# EAGLE design vga (EAGLE 5.12)

## Sheet 1 of 6
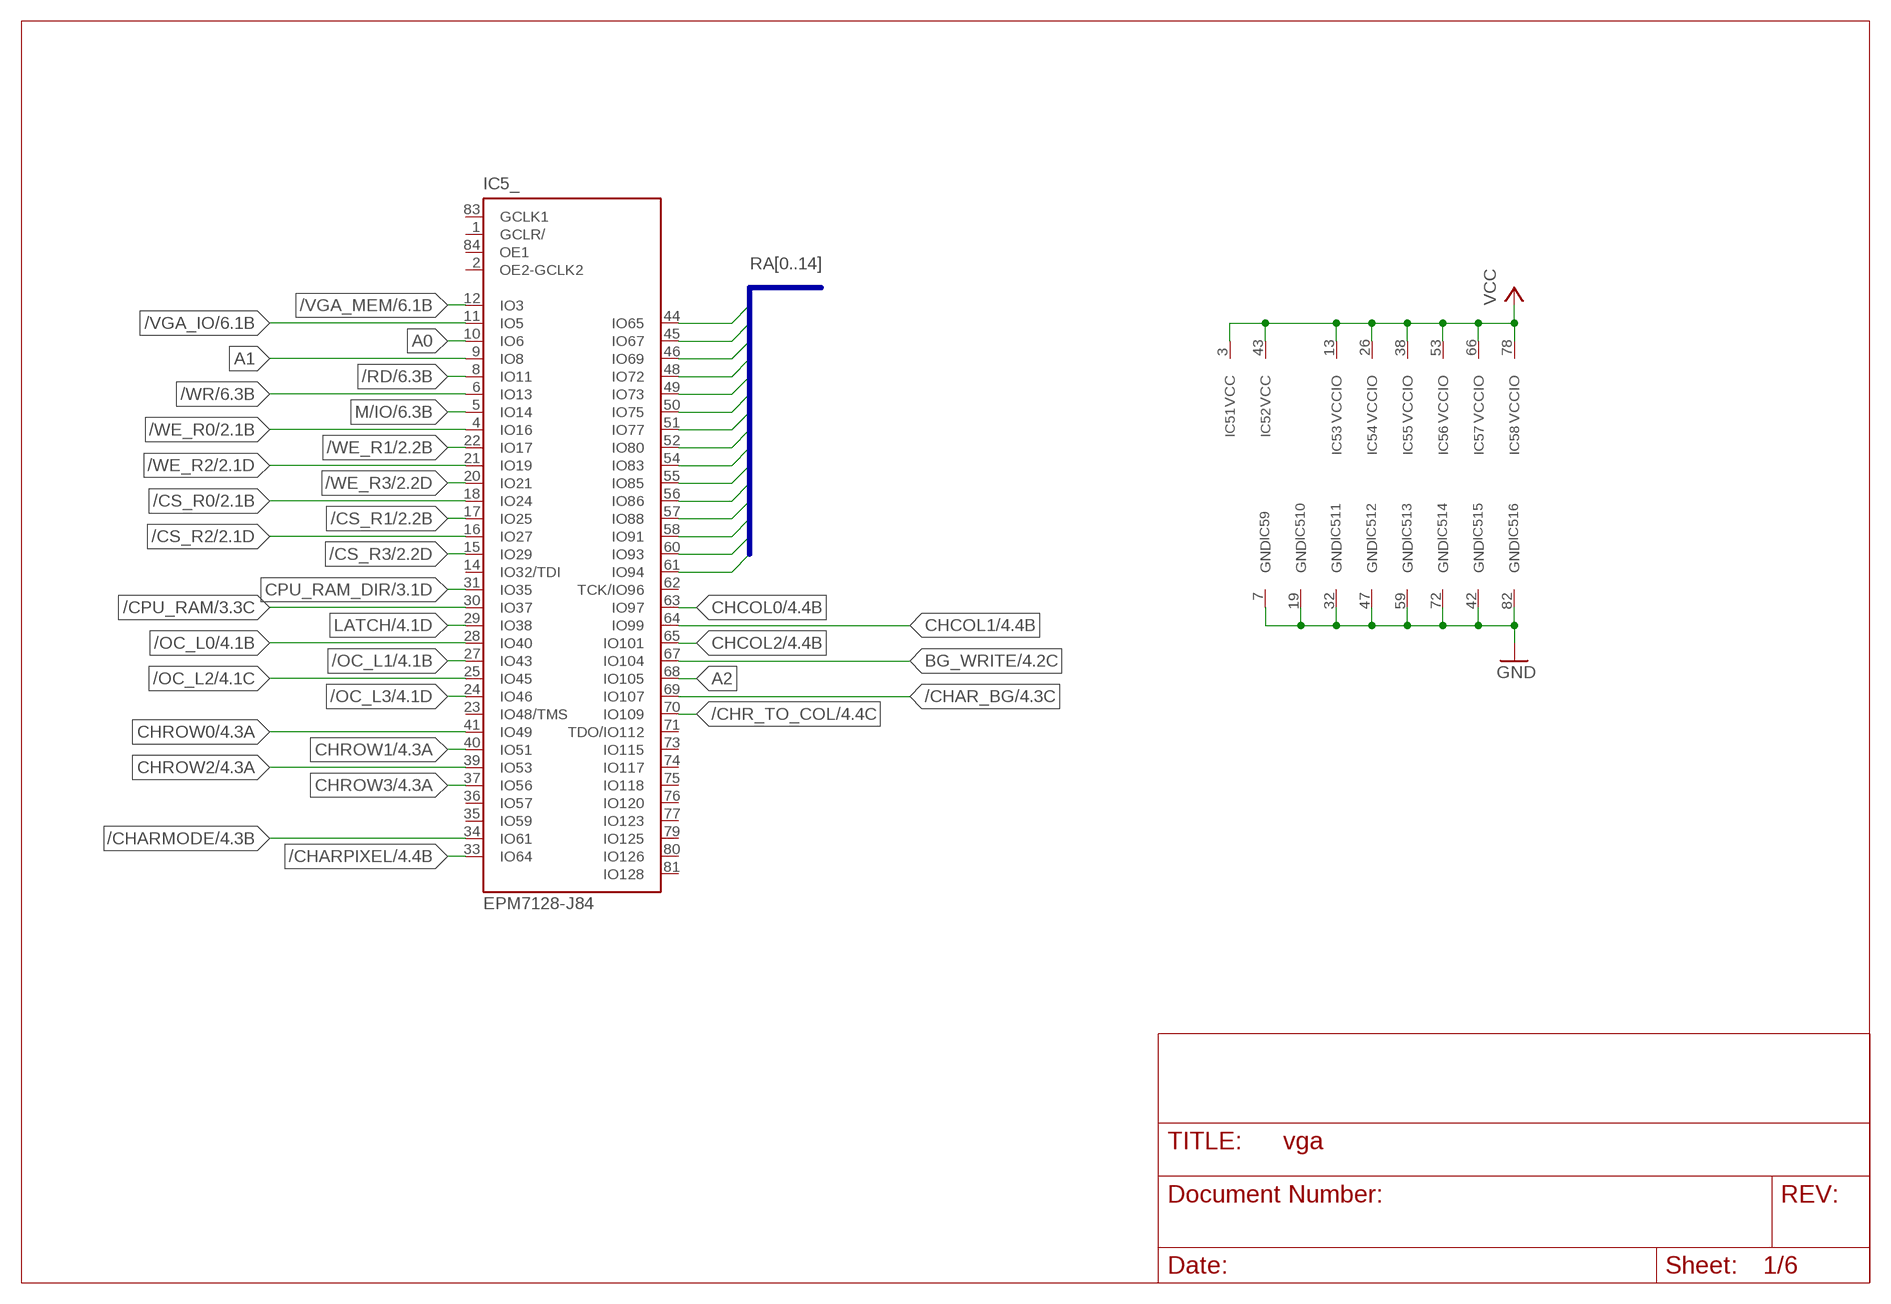
[diagram p0: schematic, sheet 1]

### Parts
IC5  EPM7128-J84  EPM7128-J84PLCC84-SOCKET  [S84]

### Nets
/CHARMODE: IC5.34(_:IO61) ; also sheet 4
/CHARPIXEL: IC5.33(_:IO64) ; also sheet 4
/CPU_RAM: IC5.30(_:IO37) ; also sheet 3
/CS_R0: IC5.18(_:IO24) ; also sheet 2
/CS_R1: IC5.17(_:IO25) ; also sheet 2
/CS_R2: IC5.16(_:IO27) ; also sheet 2
/CS_R3: IC5.15(_:IO29) ; also sheet 2
/OC_L0: IC5.28(_:IO40) ; also sheet 4
/OC_L1: IC5.27(_:IO43) ; also sheet 4
/OC_L2: IC5.25(_:IO45) ; also sheet 4
/OC_L3: IC5.24(_:IO46) ; also sheet 4
/RD: IC5.8(_:IO11) ; also sheet 6
/VGA_IO: IC5.11(_:IO5) ; also sheet 6
/VGA_MEM: IC5.12(_:IO3) ; also sheet 6
/WE_R0: IC5.4(_:IO16) ; also sheet 2
/WE_R1: IC5.22(_:IO17) ; also sheet 2
/WE_R2: IC5.21(_:IO19) ; also sheet 2
/WE_R3: IC5.20(_:IO21) ; also sheet 2
/WR: IC5.6(_:IO13) ; also sheet 6
A0: IC5.10(_:IO6) ; also sheet 6
A1: IC5.9(_:IO8) ; also sheet 6
CHROW0: IC5.41(_:IO49) ; also sheet 4
CHROW1: IC5.40(_:IO51) ; also sheet 4
CHROW2: IC5.39(_:IO53) ; also sheet 4
CHROW3: IC5.37(_:IO56) ; also sheet 4
CPU_RAM_DIR: IC5.31(_:IO35) ; also sheet 3
GND: IC5.7(9:GND) IC5.19(10:GND) IC5.32(11:GND) IC5.42(15:GND) IC5.47(12:GND) IC5.59(13:GND) IC5.72(14:GND) IC5.82(16:GND) ; also sheet 2,3,4,5,6
LATCH: IC5.29(_:IO38) ; also sheet 4
M/IO: IC5.5(_:IO14) ; also sheet 6
RA0: IC5.44(_:IO65) ; also sheet 2,3
RA1: IC5.45(_:IO67) ; also sheet 2,3
RA2: IC5.46(_:IO69) ; also sheet 2,3
RA3: IC5.48(_:IO72) ; also sheet 2,3
RA4: IC5.49(_:IO73) ; also sheet 2,3
RA5: IC5.50(_:IO75) ; also sheet 2,3
RA6: IC5.51(_:IO77) ; also sheet 2,3
RA7: IC5.52(_:IO80) ; also sheet 2,3
RA8: IC5.54(_:IO83) ; also sheet 2,3
RA9: IC5.55(_:IO85) ; also sheet 2,3
RA10: IC5.56(_:IO86) ; also sheet 2,3
RA11: IC5.57(_:IO88) ; also sheet 2,3
RA12: IC5.58(_:IO91) ; also sheet 2,3
RA13: IC5.60(_:IO93) ; also sheet 2,3
RA14: IC5.61(_:IO94) ; also sheet 2,3
VCC: IC5.3(1:VCC) IC5.13(3:VCCIO) IC5.26(4:VCCIO) IC5.38(5:VCCIO) IC5.43(2:VCC) IC5.53(6:VCCIO) IC5.66(7:VCCIO) IC5.78(8:VCCIO) ; also sheet 2,3,4,6
Unconnected: IC5.1(_:GCLR/) IC5.2(_:OE2-GCLK2) IC5.14(_:IO32/TDI) IC5.23(_:IO48/TMS) IC5.35(_:IO59) IC5.36(_:IO57) IC5.62(_:TCK/IO96) IC5.63(_:IO97) IC5.64(_:IO99) IC5.65(_:IO101) IC5.67(_:IO104) IC5.68(_:IO105) IC5.69(_:IO107) IC5.70(_:IO109) IC5.71(_:TDO/IO112) IC5.73(_:IO115) IC5.74(_:IO117) IC5.75(_:IO118) IC5.76(_:IO120) IC5.77(_:IO123) IC5.79(_:IO125) IC5.80(_:IO126) IC5.81(_:IO128) IC5.83(_:GCLK1) IC5.84(_:OE1)

### Buses
RA[0..14]

## Sheet 2 of 6
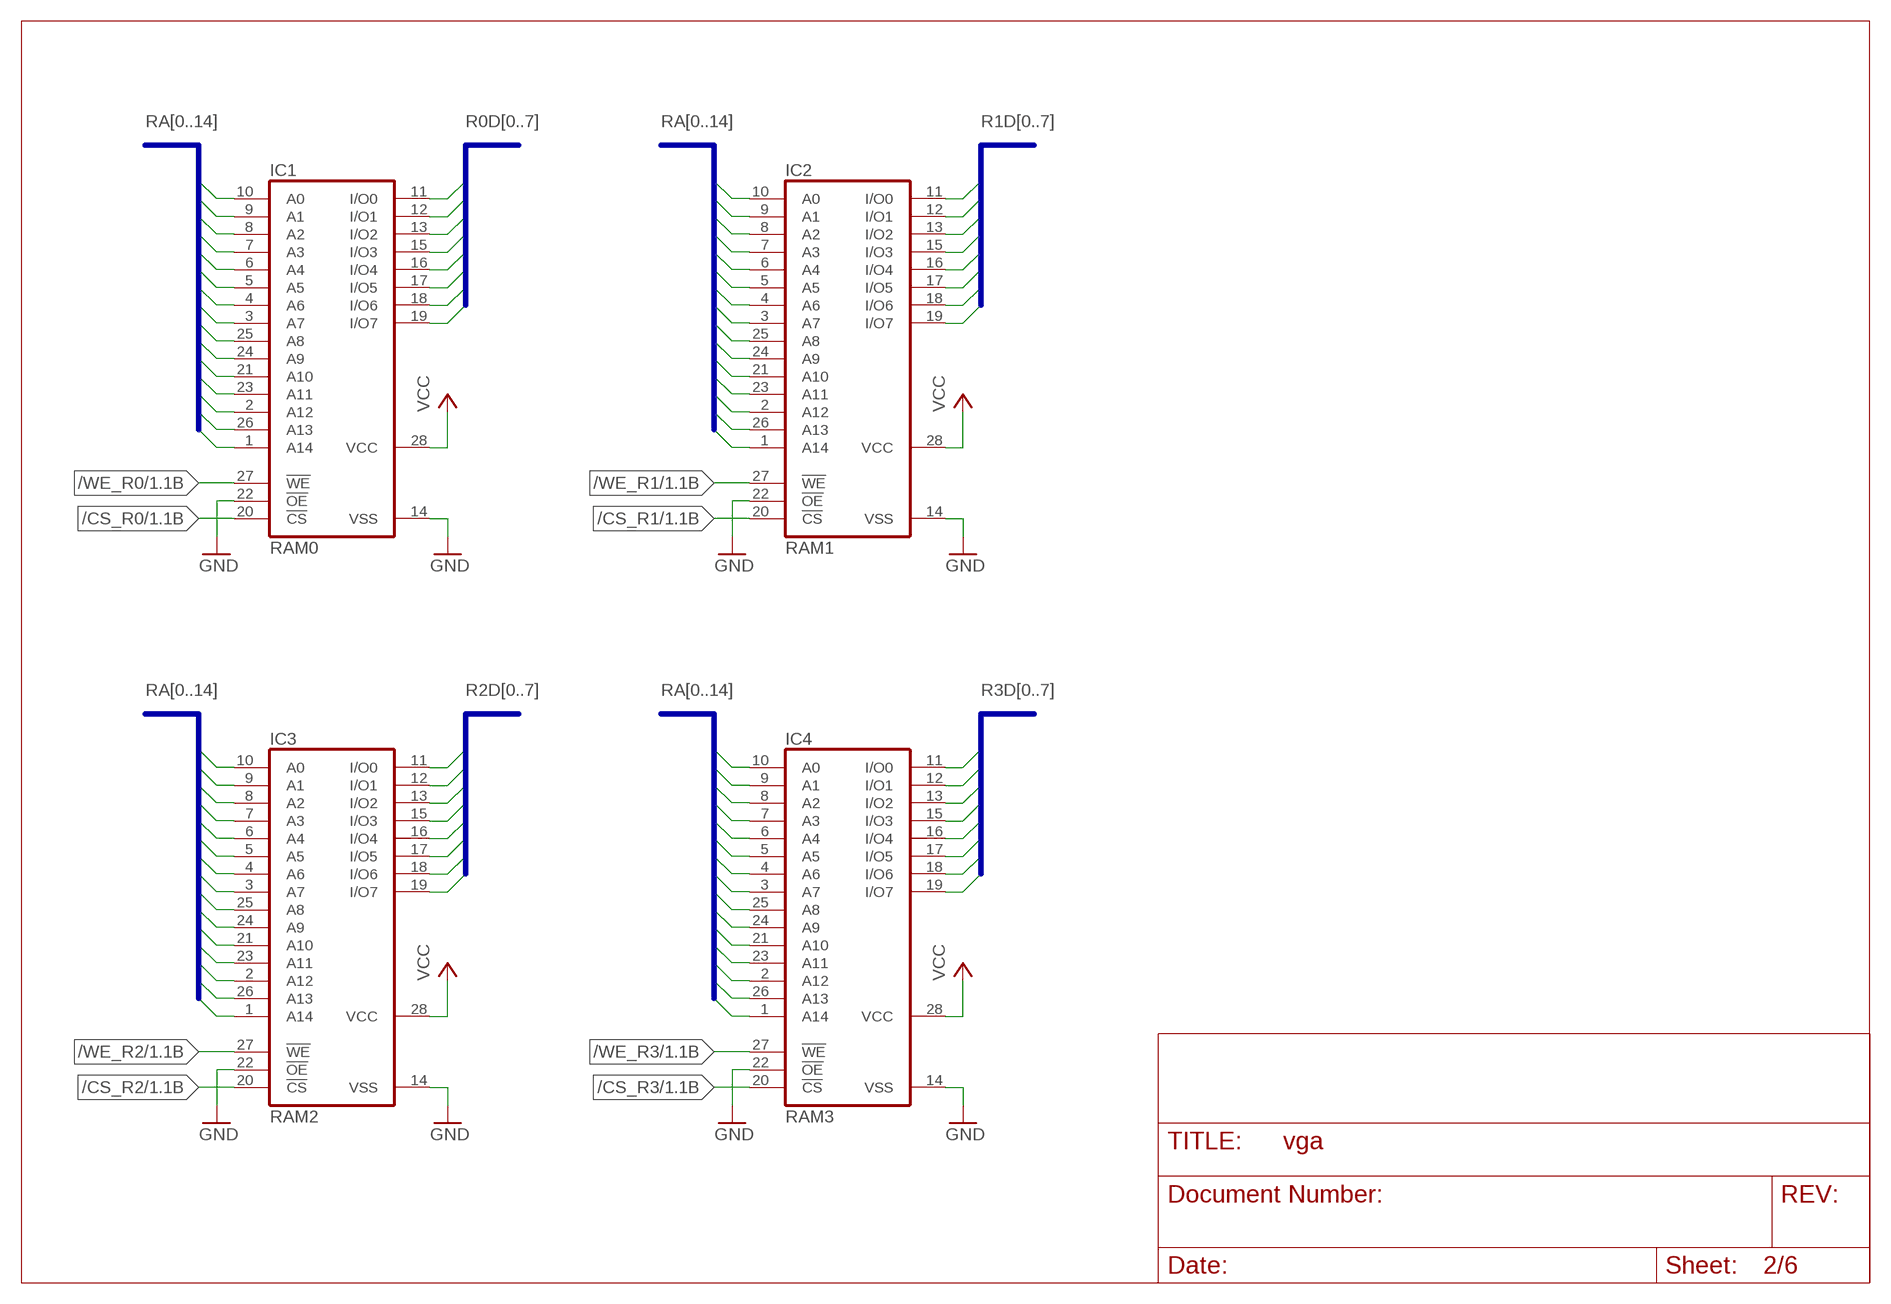
[diagram p1: schematic, sheet 2]

### Parts
IC1  RAM0  62832P  [DIL28-3]
IC2  RAM1  62832P  [DIL28-3]
IC3  RAM2  62832P  [DIL28-3]
IC4  RAM3  62832P  [DIL28-3]

### Nets
/CS_R0: IC1.20(!CS) ; also sheet 1
/CS_R1: IC2.20(!CS) ; also sheet 1
/CS_R2: IC3.20(!CS) ; also sheet 1
/CS_R3: IC4.20(!CS) ; also sheet 1
/WE_R0: IC1.27(!WE) ; also sheet 1
/WE_R1: IC2.27(!WE) ; also sheet 1
/WE_R2: IC3.27(!WE) ; also sheet 1
/WE_R3: IC4.27(!WE) ; also sheet 1
GND: IC1.14(VSS) IC1.22(!OE) IC2.14(VSS) IC2.22(!OE) IC3.14(VSS) IC3.22(!OE) IC4.14(VSS) IC4.22(!OE) ; also sheet 1,3,4,5,6
R0D0: IC1.11(I/O0) ; also sheet 3,4
R0D1: IC1.12(I/O1) ; also sheet 3,4
R0D2: IC1.13(I/O2) ; also sheet 3,4
R0D3: IC1.15(I/O3) ; also sheet 3,4
R0D4: IC1.16(I/O4) ; also sheet 3,4
R0D5: IC1.17(I/O5) ; also sheet 3,4
R0D6: IC1.18(I/O6) ; also sheet 3,4
R0D7: IC1.19(I/O7) ; also sheet 3,4
R1D0: IC2.11(I/O0) ; also sheet 3,4
R1D1: IC2.12(I/O1) ; also sheet 3,4
R1D2: IC2.13(I/O2) ; also sheet 3,4
R1D3: IC2.15(I/O3) ; also sheet 3,4
R1D4: IC2.16(I/O4) ; also sheet 3,4
R1D5: IC2.17(I/O5) ; also sheet 3,4
R1D6: IC2.18(I/O6) ; also sheet 3,4
R1D7: IC2.19(I/O7) ; also sheet 3,4
R2D0: IC3.11(I/O0) ; also sheet 3,4
R2D1: IC3.12(I/O1) ; also sheet 3,4
R2D2: IC3.13(I/O2) ; also sheet 3,4
R2D3: IC3.15(I/O3) ; also sheet 3,4
R2D4: IC3.16(I/O4) ; also sheet 3,4
R2D5: IC3.17(I/O5) ; also sheet 3,4
R2D6: IC3.18(I/O6) ; also sheet 3,4
R2D7: IC3.19(I/O7) ; also sheet 3,4
R3D0: IC4.11(I/O0) ; also sheet 3,4
R3D1: IC4.12(I/O1) ; also sheet 3,4
R3D2: IC4.13(I/O2) ; also sheet 3,4
R3D3: IC4.15(I/O3) ; also sheet 3,4
R3D4: IC4.16(I/O4) ; also sheet 3,4
R3D5: IC4.17(I/O5) ; also sheet 3,4
R3D6: IC4.18(I/O6) ; also sheet 3,4
R3D7: IC4.19(I/O7) ; also sheet 3,4
RA0: IC1.10(A0) IC2.10(A0) IC3.10(A0) IC4.10(A0) ; also sheet 1,3
RA1: IC1.9(A1) IC2.9(A1) IC3.9(A1) IC4.9(A1) ; also sheet 1,3
RA2: IC1.8(A2) IC2.8(A2) IC3.8(A2) IC4.8(A2) ; also sheet 1,3
RA3: IC1.7(A3) IC2.7(A3) IC3.7(A3) IC4.7(A3) ; also sheet 1,3
RA4: IC1.6(A4) IC2.6(A4) IC3.6(A4) IC4.6(A4) ; also sheet 1,3
RA5: IC1.5(A5) IC2.5(A5) IC3.5(A5) IC4.5(A5) ; also sheet 1,3
RA6: IC1.4(A6) IC2.4(A6) IC3.4(A6) IC4.4(A6) ; also sheet 1,3
RA7: IC1.3(A7) IC2.3(A7) IC3.3(A7) IC4.3(A7) ; also sheet 1,3
RA8: IC1.25(A8) IC2.25(A8) IC3.25(A8) IC4.25(A8) ; also sheet 1,3
RA9: IC1.24(A9) IC2.24(A9) IC3.24(A9) IC4.24(A9) ; also sheet 1,3
RA10: IC1.21(A10) IC2.21(A10) IC3.21(A10) IC4.21(A10) ; also sheet 1,3
RA11: IC1.23(A11) IC2.23(A11) IC3.23(A11) IC4.23(A11) ; also sheet 1,3
RA12: IC1.2(A12) IC2.2(A12) IC3.2(A12) IC4.2(A12) ; also sheet 1,3
RA13: IC1.26(A13) IC2.26(A13) IC3.26(A13) IC4.26(A13) ; also sheet 1,3
RA14: IC1.1(A14) IC2.1(A14) IC3.1(A14) IC4.1(A14) ; also sheet 1,3
VCC: IC1.28(VCC) IC2.28(VCC) IC3.28(VCC) IC4.28(VCC) ; also sheet 1,3,4,6

### Buses
RA[0..14]
R0D[0..7]
R1D[0..7]
R2D[0..7]
R3D[0..7]

## Sheet 3 of 6
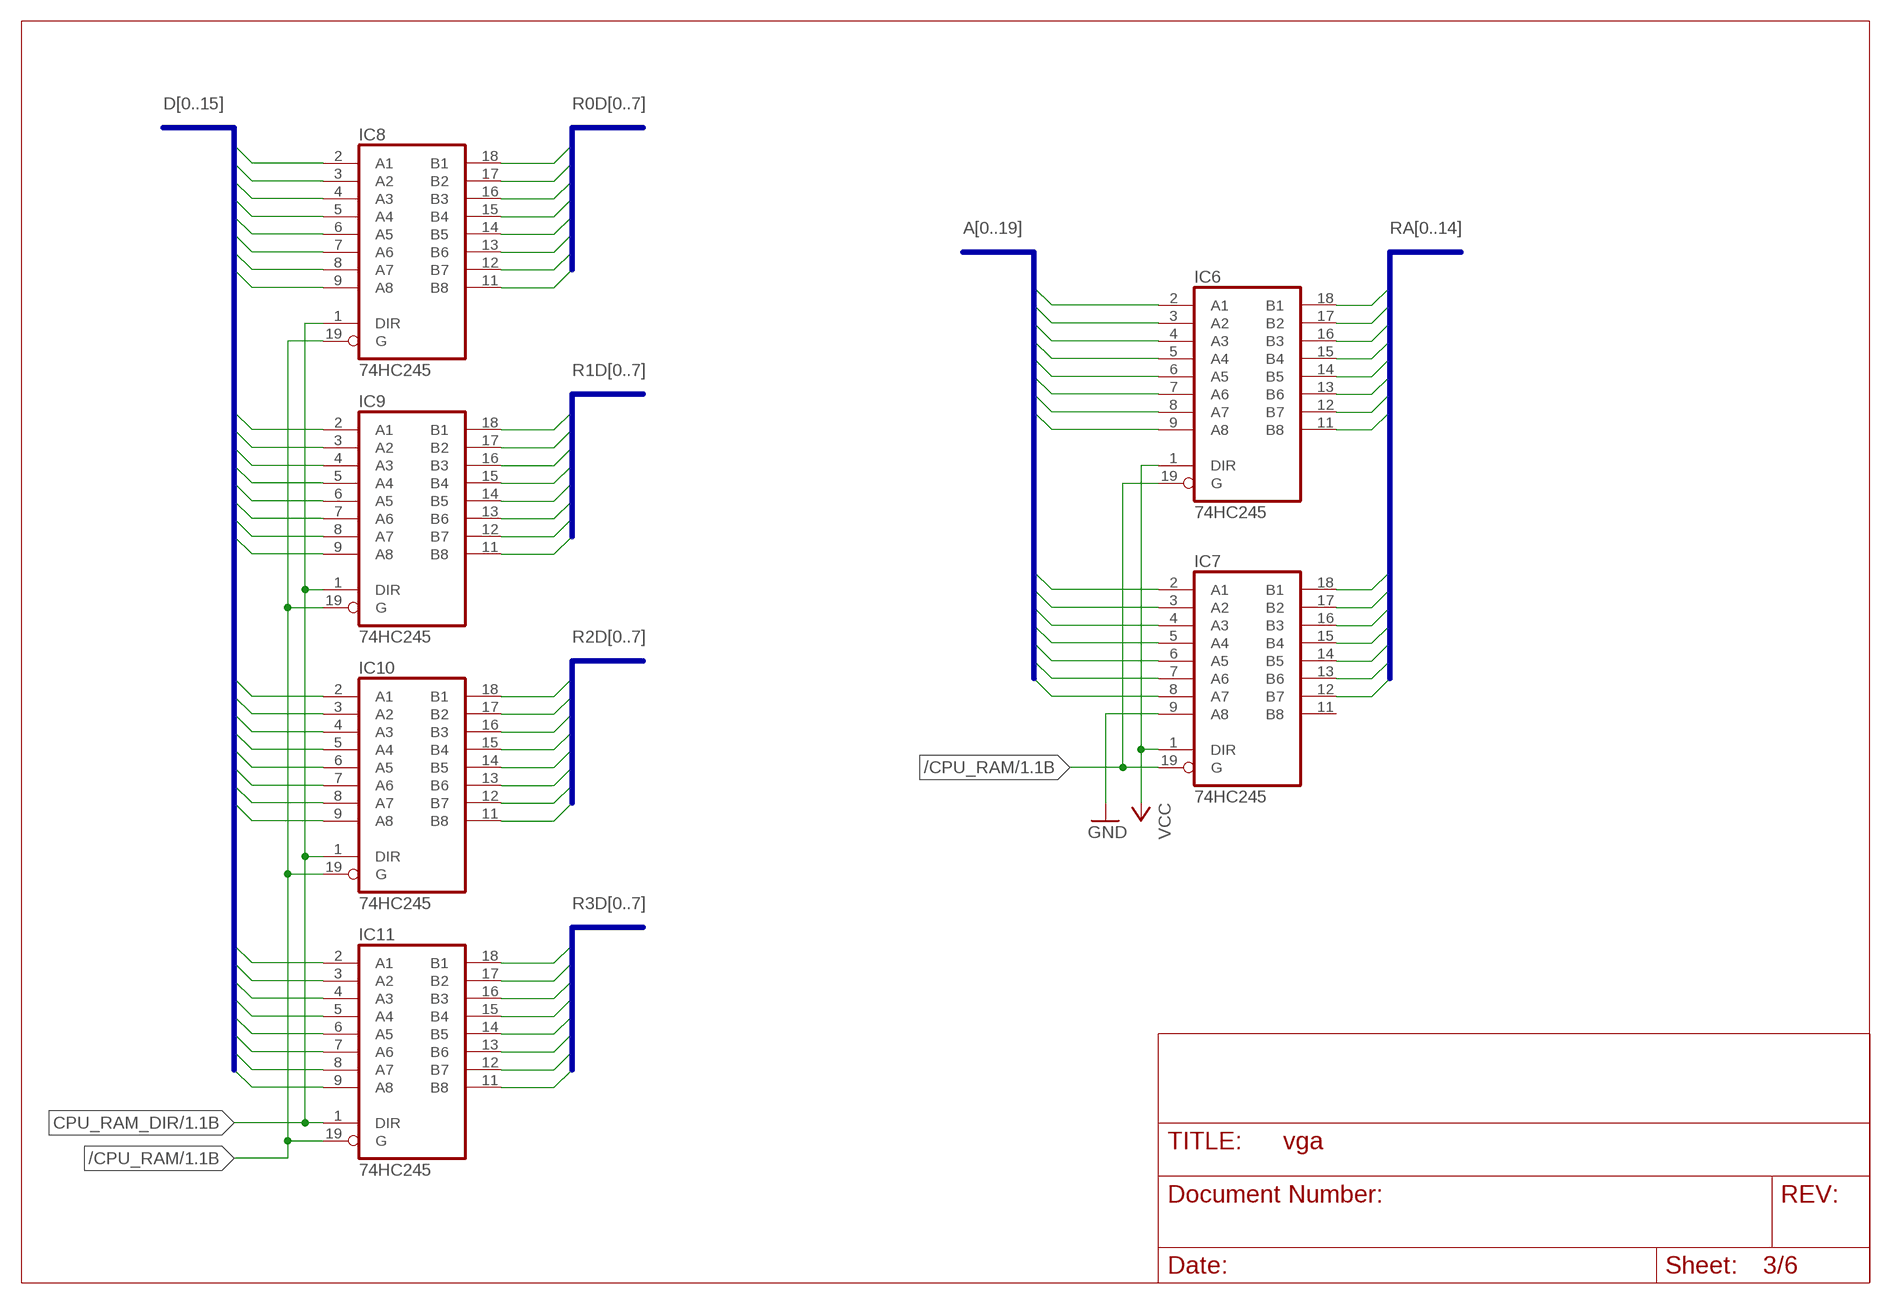
[diagram p2: schematic, sheet 3]

### Parts
IC6  74HC245  74LS245DW  [SO20W]
IC7  74HC245  74LS245DW  [SO20W]
IC8  74HC245  74LS245DW  [SO20W]
IC9  74HC245  74LS245DW  [SO20W]
IC10  74HC245  74LS245DW  [SO20W]
IC11  74HC245  74LS245DW  [SO20W]

### Nets
/CPU_RAM: IC6.19(G) IC7.19(G) IC8.19(G) IC9.19(G) IC10.19(G) IC11.19(G) ; also sheet 1
A2: IC6.2(A1) ; also sheet 1,6
A3: IC6.3(A2) ; also sheet 6
A4: IC6.4(A3) ; also sheet 6
A5: IC6.5(A4) ; also sheet 6
A6: IC6.6(A5) ; also sheet 6
A7: IC6.7(A6) ; also sheet 6
A8: IC6.8(A7) ; also sheet 6
A9: IC6.9(A8) ; also sheet 6
A10: IC7.2(A1) ; also sheet 6
A11: IC7.3(A2) ; also sheet 6
A12: IC7.4(A3) ; also sheet 6
A13: IC7.5(A4) ; also sheet 6
A14: IC7.6(A5) ; also sheet 6
A15: IC7.7(A6) ; also sheet 6
A16: IC7.8(A7) ; also sheet 6
CPU_RAM_DIR: IC8.1(DIR) IC9.1(DIR) IC10.1(DIR) IC11.1(DIR) ; also sheet 1
D0: IC8.2(A1) IC10.2(A1) ; also sheet 4,6
D1: IC8.3(A2) IC10.3(A2) ; also sheet 4,6
D2: IC8.4(A3) IC10.4(A3) ; also sheet 4,6
D3: IC8.5(A4) IC10.5(A4) ; also sheet 4,6
D4: IC8.6(A5) IC10.6(A5) ; also sheet 4,6
D5: IC8.7(A6) IC10.7(A6) ; also sheet 4,6
D6: IC8.8(A7) IC10.8(A7) ; also sheet 4,6
D7: IC8.9(A8) IC10.9(A8) ; also sheet 4,6
D8: IC9.2(A1) IC11.2(A1) ; also sheet 6
D9: IC9.3(A2) IC11.3(A2) ; also sheet 6
D10: IC9.4(A3) IC11.4(A3) ; also sheet 6
D11: IC9.5(A4) IC11.5(A4) ; also sheet 6
D12: IC9.6(A5) IC11.6(A5) ; also sheet 6
D13: IC9.7(A6) IC11.7(A6) ; also sheet 6
D14: IC9.8(A7) IC11.8(A7) ; also sheet 6
D15: IC9.9(A8) IC11.9(A8) ; also sheet 6
GND: IC7.9(A8) ; also sheet 1,2,4,5,6
R0D0: IC8.18(B1) ; also sheet 2,4
R0D1: IC8.17(B2) ; also sheet 2,4
R0D2: IC8.16(B3) ; also sheet 2,4
R0D3: IC8.15(B4) ; also sheet 2,4
R0D4: IC8.14(B5) ; also sheet 2,4
R0D5: IC8.13(B6) ; also sheet 2,4
R0D6: IC8.12(B7) ; also sheet 2,4
R0D7: IC8.11(B8) ; also sheet 2,4
R1D0: IC9.18(B1) ; also sheet 2,4
R1D1: IC9.17(B2) ; also sheet 2,4
R1D2: IC9.16(B3) ; also sheet 2,4
R1D3: IC9.15(B4) ; also sheet 2,4
R1D4: IC9.14(B5) ; also sheet 2,4
R1D5: IC9.13(B6) ; also sheet 2,4
R1D6: IC9.12(B7) ; also sheet 2,4
R1D7: IC9.11(B8) ; also sheet 2,4
R2D0: IC10.18(B1) ; also sheet 2,4
R2D1: IC10.17(B2) ; also sheet 2,4
R2D2: IC10.16(B3) ; also sheet 2,4
R2D3: IC10.15(B4) ; also sheet 2,4
R2D4: IC10.14(B5) ; also sheet 2,4
R2D5: IC10.13(B6) ; also sheet 2,4
R2D6: IC10.12(B7) ; also sheet 2,4
R2D7: IC10.11(B8) ; also sheet 2,4
R3D0: IC11.18(B1) ; also sheet 2,4
R3D1: IC11.17(B2) ; also sheet 2,4
R3D2: IC11.16(B3) ; also sheet 2,4
R3D3: IC11.15(B4) ; also sheet 2,4
R3D4: IC11.14(B5) ; also sheet 2,4
R3D5: IC11.13(B6) ; also sheet 2,4
R3D6: IC11.12(B7) ; also sheet 2,4
R3D7: IC11.11(B8) ; also sheet 2,4
RA0: IC6.18(B1) ; also sheet 1,2
RA1: IC6.17(B2) ; also sheet 1,2
RA2: IC6.16(B3) ; also sheet 1,2
RA3: IC6.15(B4) ; also sheet 1,2
RA4: IC6.14(B5) ; also sheet 1,2
RA5: IC6.13(B6) ; also sheet 1,2
RA6: IC6.12(B7) ; also sheet 1,2
RA7: IC6.11(B8) ; also sheet 1,2
RA8: IC7.18(B1) ; also sheet 1,2
RA9: IC7.17(B2) ; also sheet 1,2
RA10: IC7.16(B3) ; also sheet 1,2
RA11: IC7.15(B4) ; also sheet 1,2
RA12: IC7.14(B5) ; also sheet 1,2
RA13: IC7.13(B6) ; also sheet 1,2
RA14: IC7.12(B7) ; also sheet 1,2
VCC: IC6.1(DIR) IC7.1(DIR) ; also sheet 1,2,4,6
Unconnected: IC7.11(B8)

### Buses
D[0..15]
R3D[0..7]
R0D[0..7]
R1D[0..7]
R2D[0..7]
RA[0..14]
A[0..19]

## Sheet 4 of 6
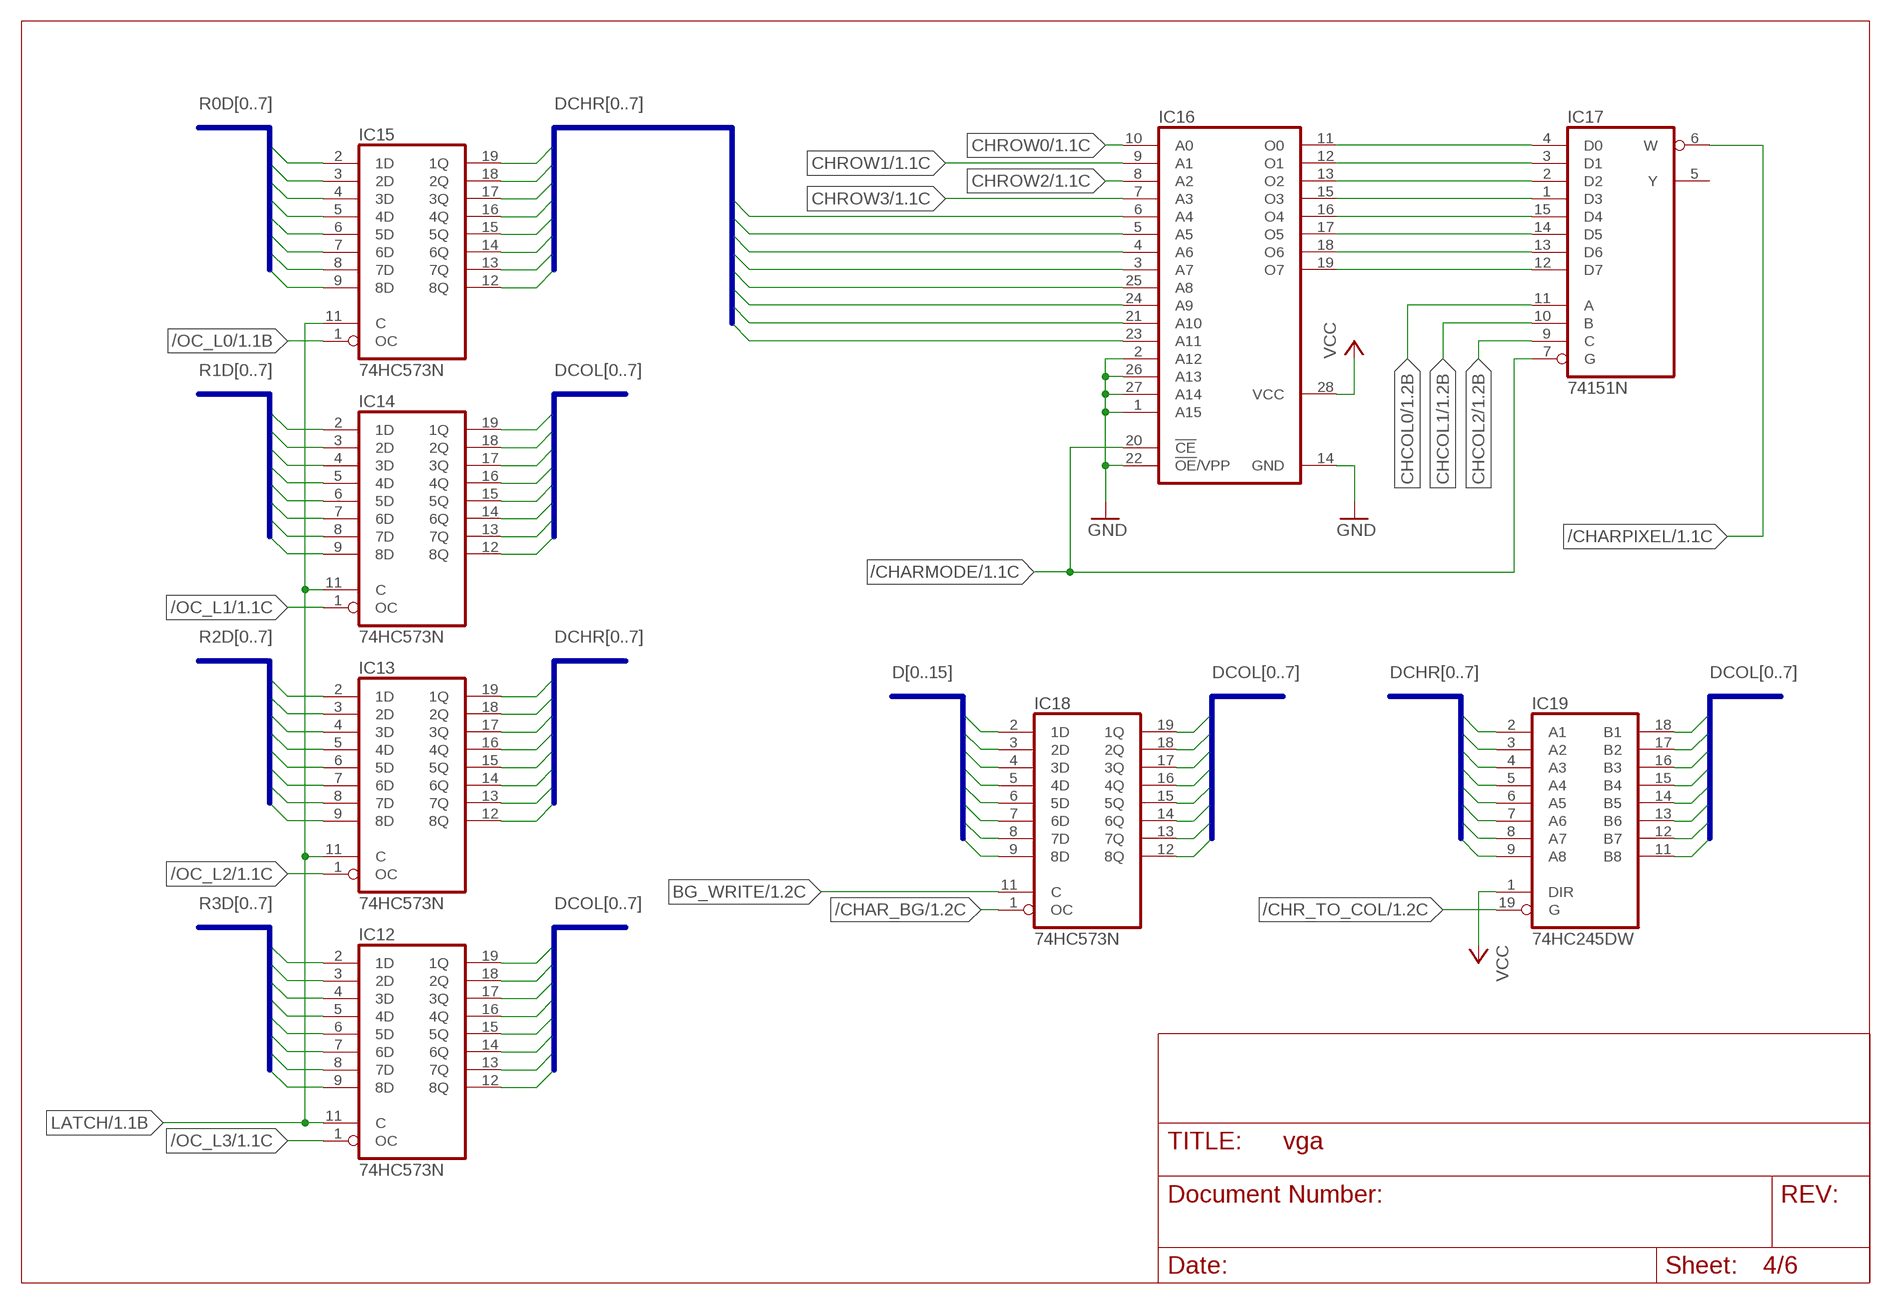
[diagram p3: schematic, sheet 4]

### Parts
IC12  74HC573N  [DIL20]
IC13  74HC573N  [DIL20]
IC14  74HC573N  [DIL20]
IC15  74HC573N  [DIL20]
IC16  27C512D  [DIL28-6]
IC17  74151N  [DIL16]
IC18  74HC573N  [DIL20]
IC19  74HC245DW  [SO20W]

### Nets
/CHAR_BG: IC18.1(OC) ; also sheet 1
/CHARMODE: IC16.20(!CE) IC17.7(G) ; also sheet 1
/CHARPIXEL: IC17.6(W) ; also sheet 1
/CHR_TO_COL: IC19.19(G) ; also sheet 1
/OC_L0: IC15.1(OC) ; also sheet 1
/OC_L1: IC14.1(OC) ; also sheet 1
/OC_L2: IC13.1(OC) ; also sheet 1
/OC_L3: IC12.1(OC) ; also sheet 1
BG_WRITE: IC18.11(C) ; also sheet 1
CHCOL0: IC17.11(A) ; also sheet 1
CHCOL1: IC17.10(B) ; also sheet 1
CHCOL2: IC17.9(C) ; also sheet 1
CHROW0: IC16.10(A0) ; also sheet 1
CHROW1: IC16.9(A1) ; also sheet 1
CHROW2: IC16.8(A2) ; also sheet 1
CHROW3: IC16.7(A3) ; also sheet 1
D0: IC18.2(1D) ; also sheet 3,6
D1: IC18.3(2D) ; also sheet 3,6
D2: IC18.4(3D) ; also sheet 3,6
D3: IC18.5(4D) ; also sheet 3,6
D4: IC18.6(5D) ; also sheet 3,6
D5: IC18.7(6D) ; also sheet 3,6
D6: IC18.8(7D) ; also sheet 3,6
D7: IC18.9(8D) ; also sheet 3,6
DCHR0: IC13.19(1Q) IC15.19(1Q) IC16.6(A4) IC19.2(A1)
DCHR1: IC13.18(2Q) IC15.18(2Q) IC16.5(A5) IC19.3(A2)
DCHR2: IC13.17(3Q) IC15.17(3Q) IC16.4(A6) IC19.4(A3)
DCHR3: IC13.16(4Q) IC15.16(4Q) IC16.3(A7) IC19.5(A4)
DCHR4: IC13.15(5Q) IC15.15(5Q) IC16.25(A8) IC19.6(A5)
DCHR5: IC13.14(6Q) IC15.14(6Q) IC16.24(A9) IC19.7(A6)
DCHR6: IC13.13(7Q) IC15.13(7Q) IC16.21(A10) IC19.8(A7)
DCHR7: IC13.12(8Q) IC15.12(8Q) IC16.23(A11) IC19.9(A8)
DCOL0: IC12.19(1Q) IC14.19(1Q) IC18.19(1Q) IC19.18(B1) ; also sheet 5
DCOL1: IC12.18(2Q) IC14.18(2Q) IC18.18(2Q) IC19.17(B2) ; also sheet 5
DCOL2: IC12.17(3Q) IC14.17(3Q) IC18.17(3Q) IC19.16(B3) ; also sheet 5
DCOL3: IC12.16(4Q) IC14.16(4Q) IC18.16(4Q) IC19.15(B4) ; also sheet 5
DCOL4: IC12.15(5Q) IC14.15(5Q) IC18.15(5Q) IC19.14(B5) ; also sheet 5
DCOL5: IC12.14(6Q) IC14.14(6Q) IC18.14(6Q) IC19.13(B6) ; also sheet 5
DCOL6: IC12.13(7Q) IC14.13(7Q) IC18.13(7Q) IC19.12(B7) ; also sheet 5
DCOL7: IC12.12(8Q) IC14.12(8Q) IC18.12(8Q) IC19.11(B8) ; also sheet 5
GND: IC16.1(A15) IC16.2(A12) IC16.14(GND) IC16.22(!OE!/VPP) IC16.26(A13) IC16.27(A14) ; also sheet 1,2,3,5,6
LATCH: IC12.11(C) IC13.11(C) IC14.11(C) IC15.11(C) ; also sheet 1
N$3: IC16.15(O3) IC17.1(D3)
N$4: IC16.13(O2) IC17.2(D2)
N$5: IC16.12(O1) IC17.3(D1)
N$6: IC16.11(O0) IC17.4(D0)
N$7: IC16.19(O7) IC17.12(D7)
N$8: IC16.18(O6) IC17.13(D6)
N$9: IC16.17(O5) IC17.14(D5)
N$10: IC16.16(O4) IC17.15(D4)
R0D0: IC15.2(1D) ; also sheet 2,3
R0D1: IC15.3(2D) ; also sheet 2,3
R0D2: IC15.4(3D) ; also sheet 2,3
R0D3: IC15.5(4D) ; also sheet 2,3
R0D4: IC15.6(5D) ; also sheet 2,3
R0D5: IC15.7(6D) ; also sheet 2,3
R0D6: IC15.8(7D) ; also sheet 2,3
R0D7: IC15.9(8D) ; also sheet 2,3
R1D0: IC14.2(1D) ; also sheet 2,3
R1D1: IC14.3(2D) ; also sheet 2,3
R1D2: IC14.4(3D) ; also sheet 2,3
R1D3: IC14.5(4D) ; also sheet 2,3
R1D4: IC14.6(5D) ; also sheet 2,3
R1D5: IC14.7(6D) ; also sheet 2,3
R1D6: IC14.8(7D) ; also sheet 2,3
R1D7: IC14.9(8D) ; also sheet 2,3
R2D0: IC13.2(1D) ; also sheet 2,3
R2D1: IC13.3(2D) ; also sheet 2,3
R2D2: IC13.4(3D) ; also sheet 2,3
R2D3: IC13.5(4D) ; also sheet 2,3
R2D4: IC13.6(5D) ; also sheet 2,3
R2D5: IC13.7(6D) ; also sheet 2,3
R2D6: IC13.8(7D) ; also sheet 2,3
R2D7: IC13.9(8D) ; also sheet 2,3
R3D0: IC12.2(1D) ; also sheet 2,3
R3D1: IC12.3(2D) ; also sheet 2,3
R3D2: IC12.4(3D) ; also sheet 2,3
R3D3: IC12.5(4D) ; also sheet 2,3
R3D4: IC12.6(5D) ; also sheet 2,3
R3D5: IC12.7(6D) ; also sheet 2,3
R3D6: IC12.8(7D) ; also sheet 2,3
R3D7: IC12.9(8D) ; also sheet 2,3
VCC: IC16.28(VCC) IC19.1(DIR) ; also sheet 1,2,3,6
Unconnected: IC17.5(Y)

### Buses
R3D[0..7]
R0D[0..7]
R1D[0..7]
R2D[0..7]
DCOL[0..7]
DCHR[0..7]
D[0..15]

## Sheet 5 of 6
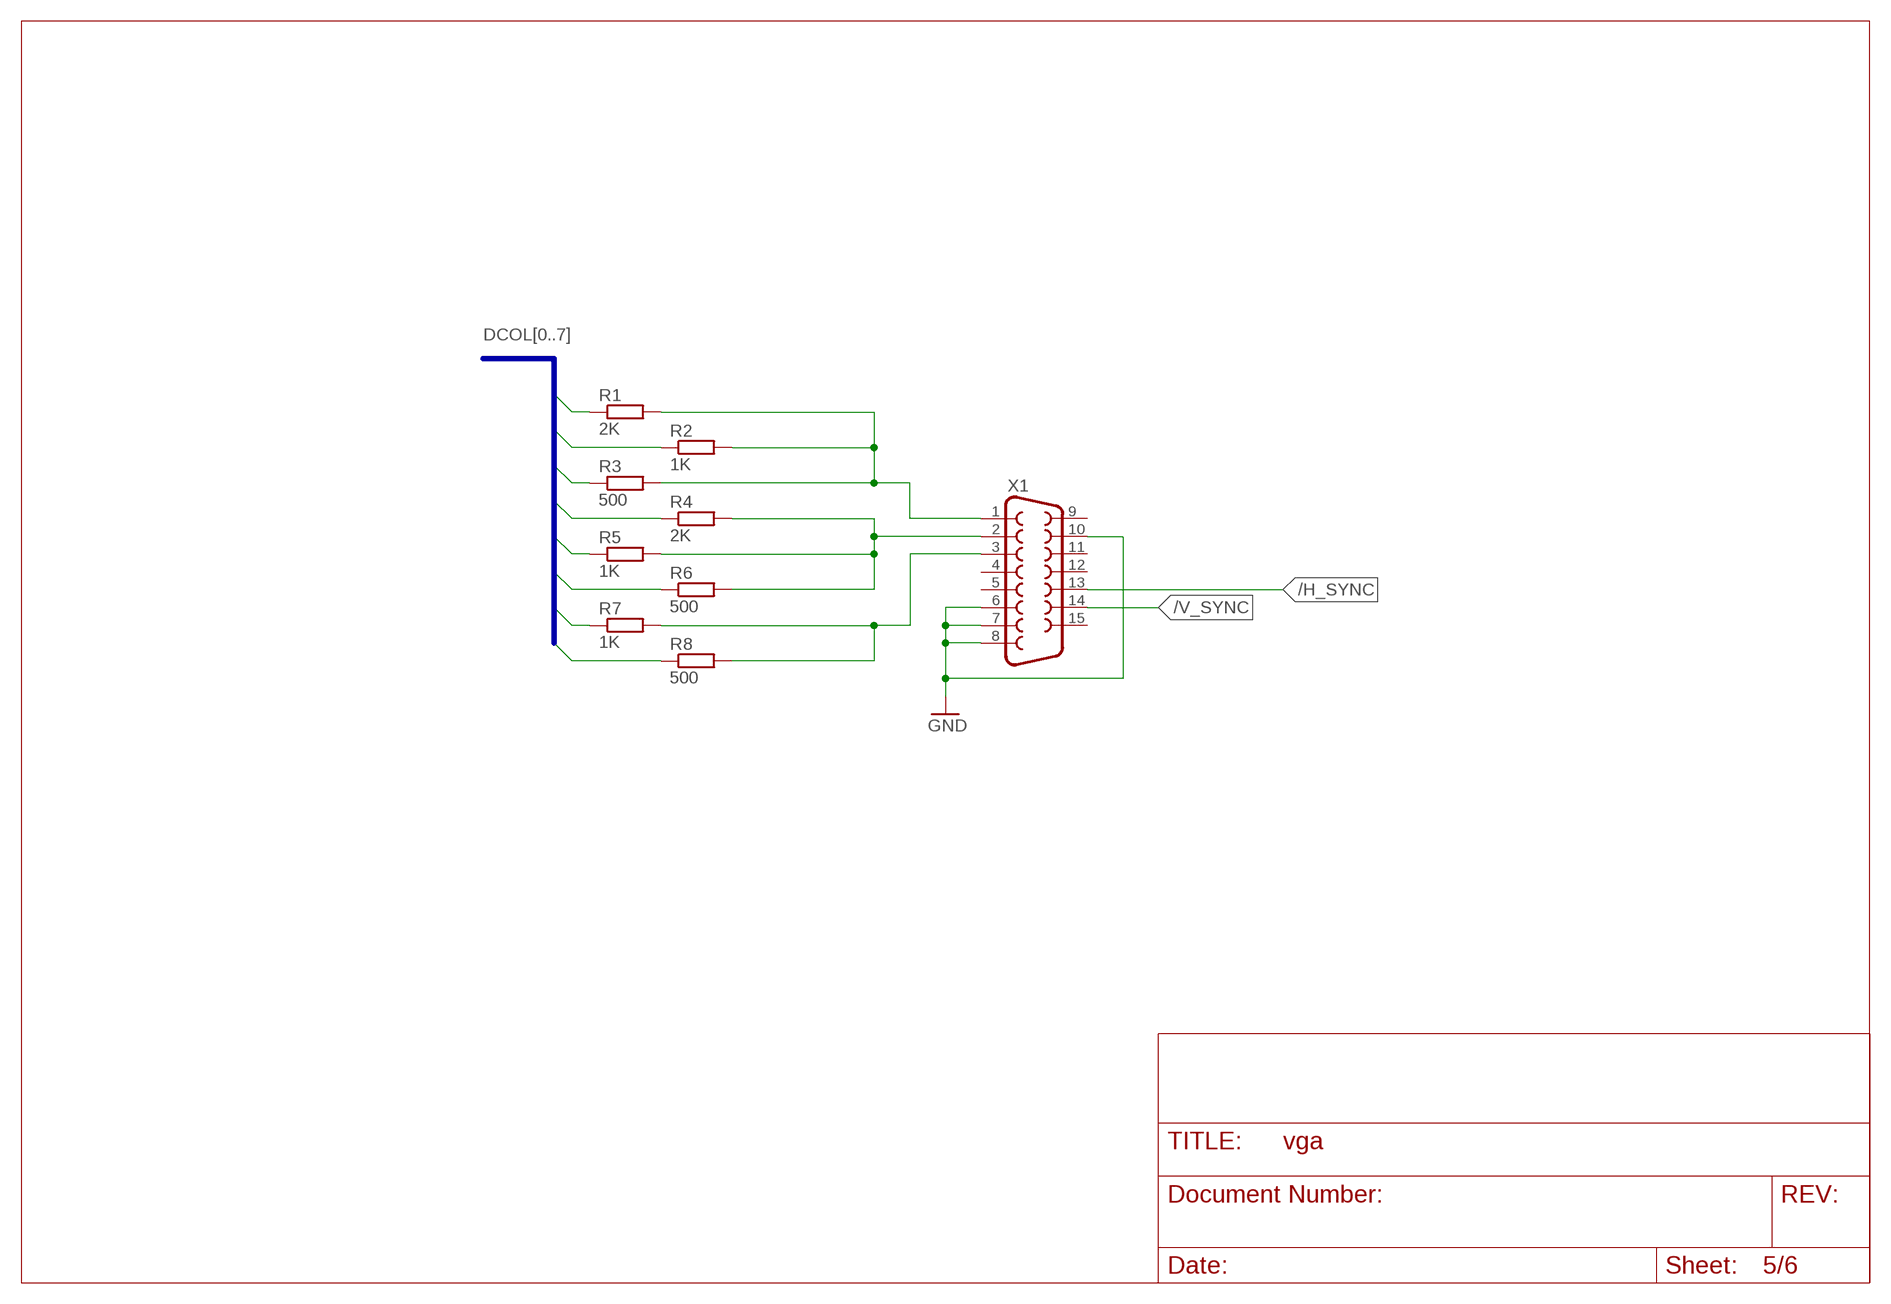
[diagram p4: schematic, sheet 5]

### Parts
R1  2K  R-EU_0207/2V  [0207/2V]
R2  1K  R-EU_0207/2V  [0207/2V]
R3  500  R-EU_0207/2V  [0207/2V]
R4  2K  R-EU_0207/2V  [0207/2V]
R5  1K  R-EU_0207/2V  [0207/2V]
R6  500  R-EU_0207/2V  [0207/2V]
R7  1K  R-EU_0207/2V  [0207/2V]
R8  500  R-EU_0207/2V  [0207/2V]
X1  F15HDH  [HDF15H]

### Nets
/H_SYNC: X1.13
/V_SYNC: X1.14
DCOL0: R1.1 ; also sheet 4
DCOL1: R2.1 ; also sheet 4
DCOL2: R3.1 ; also sheet 4
DCOL3: R4.1 ; also sheet 4
DCOL4: R5.1 ; also sheet 4
DCOL5: R6.1 ; also sheet 4
DCOL6: R7.1 ; also sheet 4
DCOL7: R8.1 ; also sheet 4
GND: X1.6 X1.7 X1.8 X1.10 ; also sheet 1,2,3,4,6
RGB_B: R7.2 R8.2 X1.3
RGB_G: R4.2 R5.2 R6.2 X1.2
RGB_R: R1.2 R2.2 R3.2 X1.1
Unconnected: X1.4 X1.5 X1.9 X1.11 X1.12 X1.15

### Buses
DCOL[0..7]

## Sheet 6 of 6
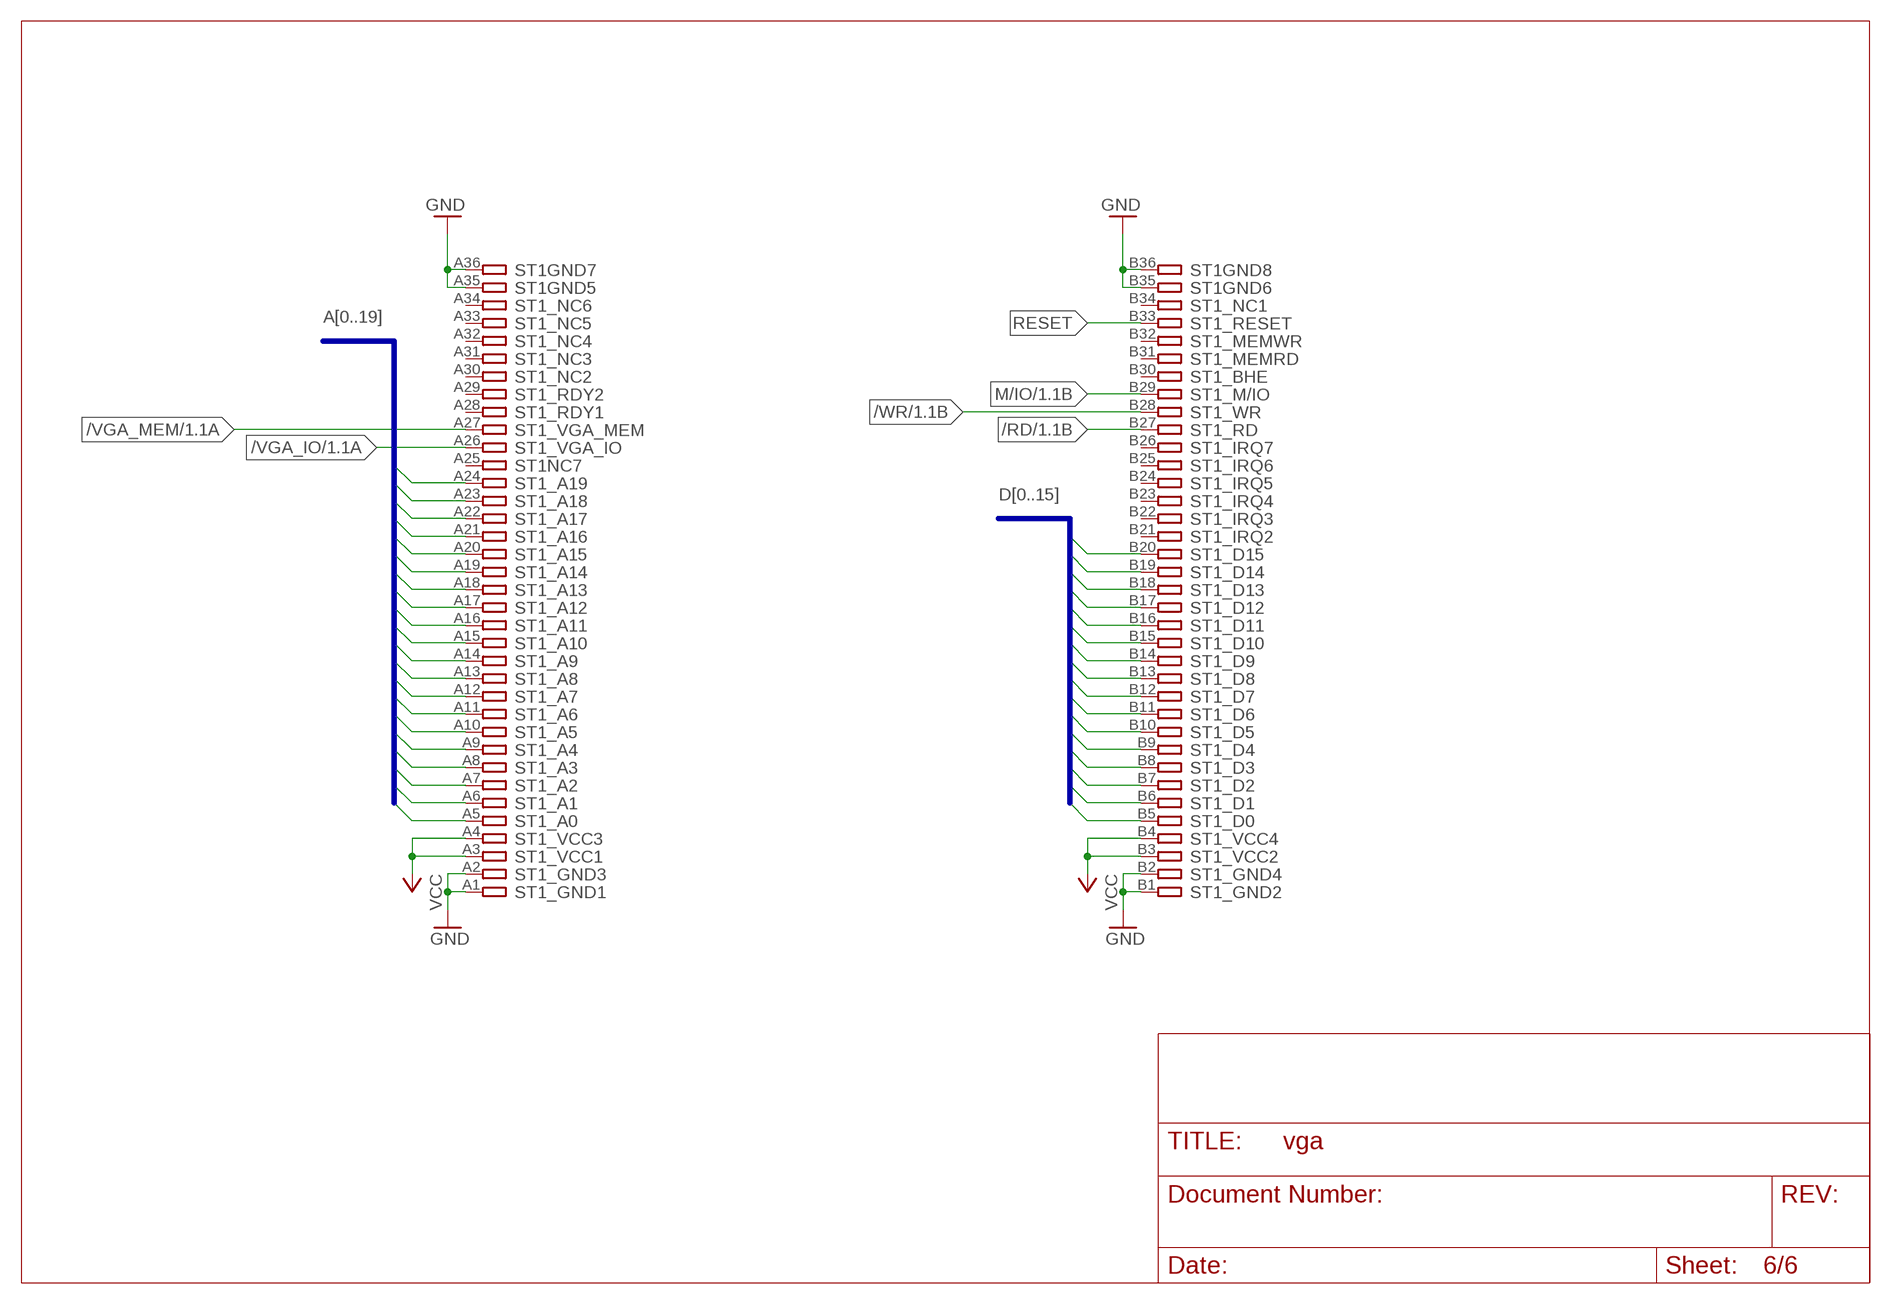
[diagram p5: schematic, sheet 6]

### Parts
ST1  MINI8086_EDGE  [MINI8086_CON]

### Nets
/RD: ST1.B27 ; also sheet 1
/VGA_IO: ST1.A26 ; also sheet 1
/VGA_MEM: ST1.A27 ; also sheet 1
/WR: ST1.B28 ; also sheet 1
A0: ST1.A5 ; also sheet 1
A1: ST1.A6 ; also sheet 1
A2: ST1.A7 ; also sheet 1,3
A3: ST1.A8 ; also sheet 3
A4: ST1.A9 ; also sheet 3
A5: ST1.A10 ; also sheet 3
A6: ST1.A11 ; also sheet 3
A7: ST1.A12 ; also sheet 3
A8: ST1.A13 ; also sheet 3
A9: ST1.A14 ; also sheet 3
A10: ST1.A15 ; also sheet 3
A11: ST1.A16 ; also sheet 3
A12: ST1.A17 ; also sheet 3
A13: ST1.A18 ; also sheet 3
A14: ST1.A19 ; also sheet 3
A15: ST1.A20 ; also sheet 3
A16: ST1.A21 ; also sheet 3
A17: ST1.A22
A18: ST1.A23
A19: ST1.A24
D0: ST1.B5 ; also sheet 3,4
D1: ST1.B6 ; also sheet 3,4
D2: ST1.B7 ; also sheet 3,4
D3: ST1.B8 ; also sheet 3,4
D4: ST1.B9 ; also sheet 3,4
D5: ST1.B10 ; also sheet 3,4
D6: ST1.B11 ; also sheet 3,4
D7: ST1.B12 ; also sheet 3,4
D8: ST1.B13 ; also sheet 3
D9: ST1.B14 ; also sheet 3
D10: ST1.B15 ; also sheet 3
D11: ST1.B16 ; also sheet 3
D12: ST1.B17 ; also sheet 3
D13: ST1.B18 ; also sheet 3
D14: ST1.B19 ; also sheet 3
D15: ST1.B20 ; also sheet 3
GND: ST1.A1 ST1.A2 ST1.A35 ST1.A36 ST1.B1 ST1.B2 ST1.B35 ST1.B36 ; also sheet 1,2,3,4,5
M/IO: ST1.B29 ; also sheet 1
RESET: ST1.B33
VCC: ST1.A3 ST1.A4 ST1.B3 ST1.B4 ; also sheet 1,2,3,4
Unconnected: ST1.A25 ST1.A28 ST1.A29 ST1.A30 ST1.A31 ST1.A32 ST1.A33 ST1.A34 ST1.B21 ST1.B22 ST1.B23 ST1.B24 ST1.B25 ST1.B26 ST1.B30 ST1.B31 ST1.B32 ST1.B34

### Buses
D[0..15]
A[0..19]

## Power pins joined to a net without a drawn wire
GND: IC6.10(GND) IC7.10(GND) IC8.10(GND) IC9.10(GND) IC10.10(GND) IC11.10(GND) IC12.10(GND) IC13.10(GND) IC14.10(GND) IC15.10(GND) IC17.8(GND) IC18.10(GND) IC19.10(GND)
VCC: IC6.20(VCC) IC7.20(VCC) IC8.20(VCC) IC9.20(VCC) IC10.20(VCC) IC11.20(VCC) IC12.20(VCC) IC13.20(VCC) IC14.20(VCC) IC15.20(VCC) IC17.16(VCC) IC18.20(VCC) IC19.20(VCC)

## Library data of the parts
IC1-IC4 = memory-hitachi:62832P: MEMORY; OC_FARNELL: unknown; OC_NEWARK: unknown
IC5 = altera:EPM7128-J84: EPM70128 MAX 7000 family
IC6-IC11 = 74xx-us:74*245: Octal BUS TRANSCEIVER, 3-state
IC12-IC15 IC18 = 74xx-us:74*573: 8-bit D latch BUS DRIVER
IC16 = memory-nec:27C512D: MEMORY; MPN: M27C512-10F1; OC_FARNELL: 1661676; OC_NEWARK: 56P9224
IC17 = 74xx-us:74*151: Data SELECTOR/MULTIPLEXER
IC19 = 74xx-eu:74*245: Octal BUS TRANSCEIVER, 3-state
R1-R8 = rcl:R-EU_: RESISTOR, European symbol
ST1 = con-mini8086:MINI8086_EDGE: Mini8086 slot connector
X1 = con-subd:F15: SUB-D; OC_FARNELL: unknown; OC_NEWARK: unknown

## Board
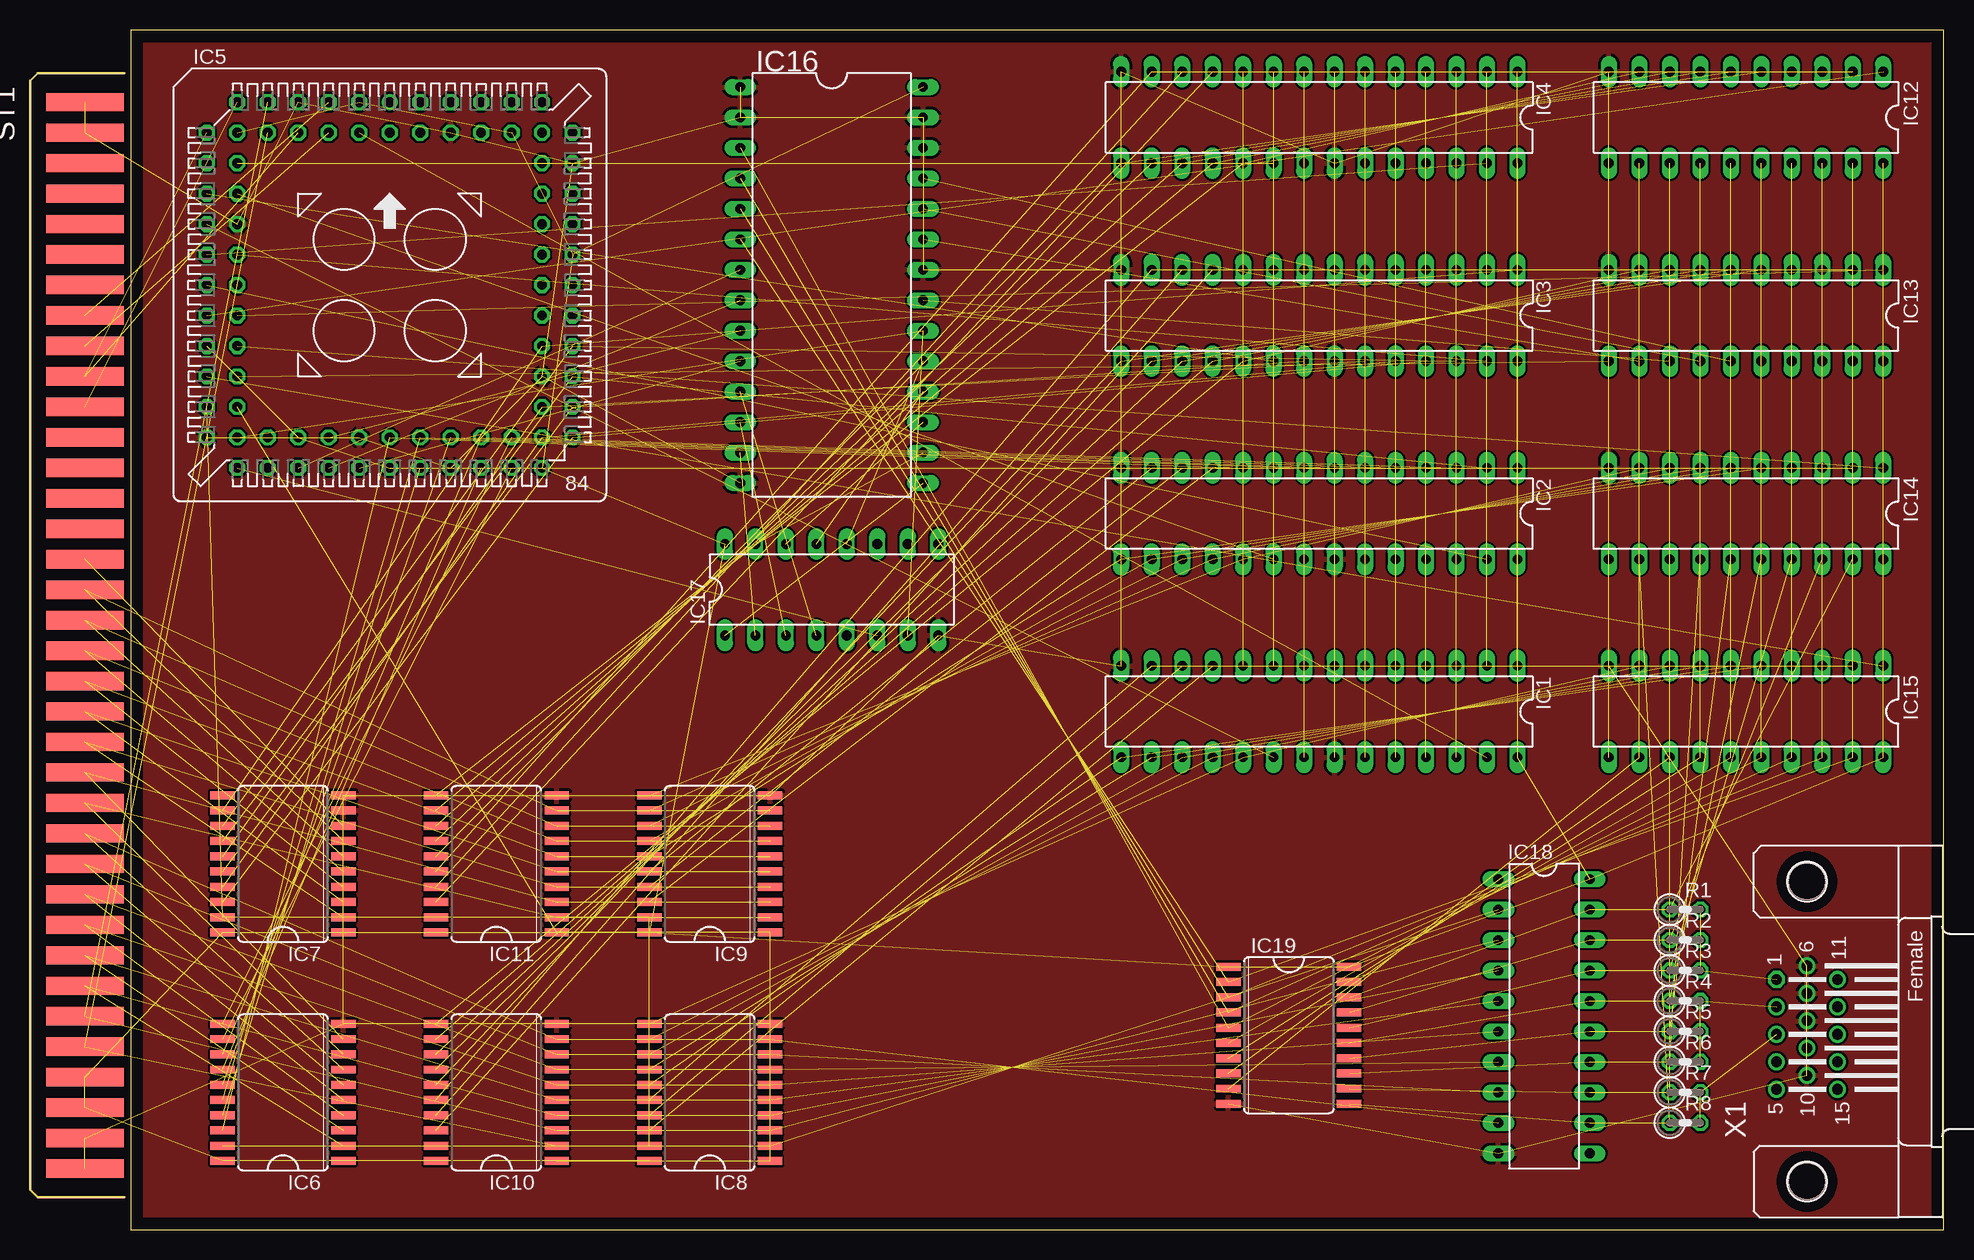
[diagram p6: board, top side]
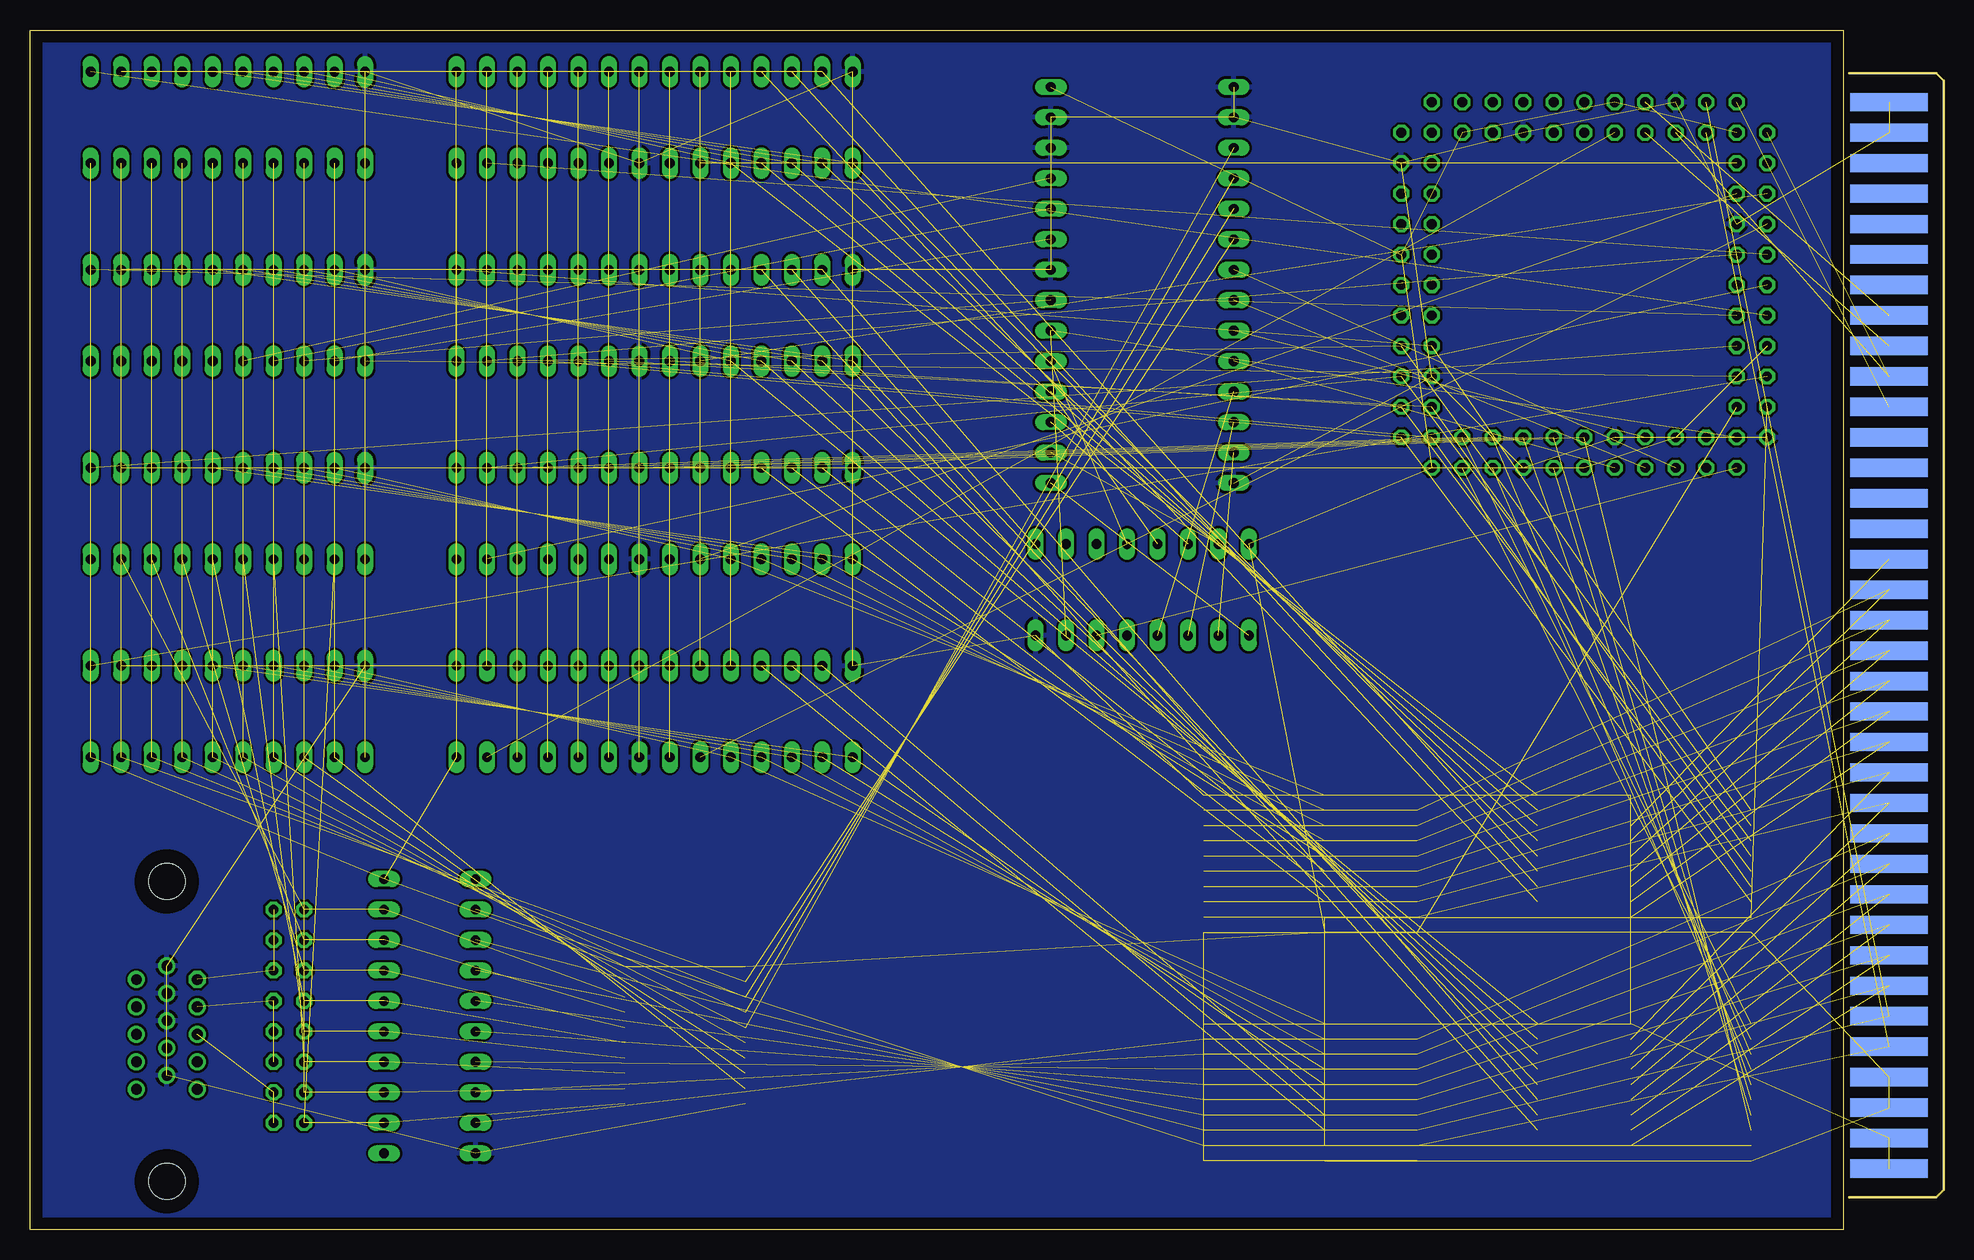
[diagram p7: board, bottom side, seen from below]

Size 151.11 x 100 mm. Coordinates in mm from the lower left corner, seen from the top.
Outline: 0,0 151.11,0 151.11,100 0,100 0,0
Copper layers (1*16): Top 0.035mm / dielectric 1.5mm / Bottom 0.035mm
Design rules "default": minimum track width 10mil, minimum drill 24mil, track to track 8mil, track to pad 8mil, pad to pad 8mil, via to via 8mil, smd to smd 8mil, copper to edge 40mil, drill to drill 8mil, minimum pad ring 10mil, minimum via ring 8mil, stop-mask expansion 4mil, vias tented up to drill 0mil, thermal gap 10mil

### Footprints (pad centres in the part's own frame; a part is rotated, then mirrored left to right if it is on the bottom)
DIL28-3 = drill 0.813 long: 1 -16.51,-3.81; 2 -13.97,-3.81; 3 -11.43,-3.81; 4 -8.89,-3.81; 5 -6.35,-3.81; 6 -3.81,-3.81; 7 -1.27,-3.81; 8 1.27,-3.81; 9 3.81,-3.81; 10 6.35,-3.81; 11 8.89,-3.81; 12 11.43,-3.81; 13 13.97,-3.81; 14 16.51,-3.81; 15 16.51,3.81; 16 13.97,3.81; 17 11.43,3.81; 18 8.89,3.81; 19 6.35,3.81; 20 3.81,3.81; 21 1.27,3.81; 22 -1.27,3.81; 23 -3.81,3.81; 24 -6.35,3.81; 25 -8.89,3.81; 26 -11.43,3.81; 27 -13.97,3.81; 28 -16.51,3.81
S84 = drill 0.813 round: 1 0,15.24 | drill 0.813 octagon: 2 0,12.7; 3 -2.54,15.24; 4 -2.54,12.7; 5 -5.08,15.24; 6 -5.08,12.7; 7 -7.62,15.24; 8 -7.62,12.7; 9 -10.16,15.24; 10 -10.16,12.7; 11 -12.7,15.24; 12 -15.24,12.7; 13 -12.7,12.7; 14 -15.24,10.16; 15 -12.7,10.16; 16 -15.24,7.62; 17 -12.7,7.62; 18 -15.24,5.08; 19 -12.7,5.08; 20 -15.24,2.54; 21 -12.7,2.54; 22 -15.24,0; 23 -12.7,0; 24 -15.24,-2.54; 25 -12.7,-2.54; 26 -15.24,-5.08; 27 -12.7,-5.08; 28 -15.24,-7.62; 29 -12.7,-7.62; 30 -15.24,-10.16; 31 -12.7,-10.16; 32 -15.24,-12.7; 33 -12.7,-15.24; 34 -12.7,-12.7; 35 -10.16,-15.24; 36 -10.16,-12.7; 37 -7.62,-15.24; 38 -7.62,-12.7; 39 -5.08,-15.24; 40 -5.08,-12.7; 41 -2.54,-15.24; 42 -2.54,-12.7; 43 0,-15.24; 44 0,-12.7; 45 2.54,-15.24; 46 2.54,-12.7; 47 5.08,-15.24; 48 5.08,-12.7; 49 7.62,-15.24; 50 7.62,-12.7; 51 10.16,-15.24; 52 10.16,-12.7; 53 12.7,-15.24; 54 15.24,-12.7; 55 12.7,-12.7; 56 15.24,-10.16; 57 12.7,-10.16; 58 15.24,-7.62; 59 12.7,-7.62; 60 15.24,-5.08; 61 12.7,-5.08; 62 15.24,-2.54; 63 12.7,-2.54; 64 15.24,0; 65 12.7,0; 66 15.24,2.54; 67 12.7,2.54; 68 15.24,5.08; 69 12.7,5.08; 70 15.24,7.62; 71 12.7,7.62; 72 15.24,10.16; 73 12.7,10.16; 74 15.24,12.7; 75 12.7,15.24; 76 12.7,12.7; 77 10.16,15.24; 78 10.16,12.7; 79 7.62,15.24; 80 7.62,12.7; 81 5.08,15.24; 82 5.08,12.7; 83 2.54,15.24; 84 2.54,12.7
SO20W = smd 0.66 x 2.032: 1 -5.715,-5.029; 2 -4.445,-5.029; 3 -3.175,-5.029; 4 -1.905,-5.029; 5 -0.635,-5.029; 6 0.635,-5.029; 7 1.905,-5.029; 8 3.175,-5.029; 9 4.445,-5.029; 10 5.715,-5.029; 11 5.715,5.029; 12 4.445,5.029; 13 3.175,5.029; 14 1.905,5.029; 15 0.635,5.029; 16 -0.635,5.029; 17 -1.905,5.029; 18 -3.175,5.029; 19 -4.445,5.029; 20 -5.715,5.029
DIL20 = drill 0.813 long: 1 -11.43,-3.81; 2 -8.89,-3.81; 3 -6.35,-3.81; 4 -3.81,-3.81; 5 -1.27,-3.81; 6 1.27,-3.81; 7 3.81,-3.81; 8 6.35,-3.81; 9 8.89,-3.81; 10 11.43,-3.81; 11 11.43,3.81; 12 8.89,3.81; 13 6.35,3.81; 14 3.81,3.81; 15 1.27,3.81; 16 -1.27,3.81; 17 -3.81,3.81; 18 -6.35,3.81; 19 -8.89,3.81; 20 -11.43,3.81
DIL28-6 = drill 0.813 long: 1 -16.51,-7.62; 2 -13.97,-7.62; 3 -11.43,-7.62; 4 -8.89,-7.62; 5 -6.35,-7.62; 6 -3.81,-7.62; 7 -1.27,-7.62; 8 1.27,-7.62; 9 3.81,-7.62; 10 6.35,-7.62; 11 8.89,-7.62; 12 11.43,-7.62; 13 13.97,-7.62; 14 16.51,-7.62; 15 16.51,7.62; 16 13.97,7.62; 17 11.43,7.62; 18 8.89,7.62; 19 6.35,7.62; 20 3.81,7.62; 21 1.27,7.62; 22 -1.27,7.62; 23 -3.81,7.62; 24 -6.35,7.62; 25 -8.89,7.62; 26 -11.43,7.62; 27 -13.97,7.62; 28 -16.51,7.62
DIL16 = drill 0.813 long: 1 -8.89,-3.81; 2 -6.35,-3.81; 3 -3.81,-3.81; 4 -1.27,-3.81; 5 1.27,-3.81; 6 3.81,-3.81; 7 6.35,-3.81; 8 8.89,-3.81; 9 8.89,3.81; 10 6.35,3.81; 11 3.81,3.81; 12 1.27,3.81; 13 -1.27,3.81; 14 -3.81,3.81; 15 -6.35,3.81; 16 -8.89,3.81
0207/2V = drill 0.813 octagon: 1 -1.27,0; 2 1.27,0
MINI8086_CON = smd 1.524 x 6.477: A1 -5.08,5.08; A2 -7.62,5.08; A3 -10.16,5.08; A4 -12.7,5.08; A5 -15.24,5.08; A6 -17.78,5.08; A7 -20.32,5.08; A8 -22.86,5.08; A9 -25.4,5.08; A10 -27.94,5.08; A11 -30.48,5.08; A12 -33.02,5.08; A13 -35.56,5.08; A14 -38.1,5.08; A15 -40.64,5.08; A16 -43.18,5.08; A17 -45.72,5.08; A18 -48.26,5.08; A19 -50.8,5.08; A20 -53.34,5.08; A21 -55.88,5.08; A22 -58.42,5.08; A23 -60.96,5.08; A24 -63.5,5.08; A25 -66.04,5.08; A26 -68.58,5.08; A27 -71.12,5.08; A28 -73.66,5.08; A29 -76.2,5.08; A30 -78.74,5.08; A31 -81.28,5.08; A32 -83.82,5.08; A33 -86.36,5.08; A34 -88.9,5.08; A35 -91.44,5.08; A36 -93.98,5.08 | smd 1.524 x 6.477 bottom: B1 -5.08,5.08; B2 -7.62,5.08; B3 -10.16,5.08; B4 -12.7,5.08; B5 -15.24,5.08; B6 -17.78,5.08; B7 -20.32,5.08; B8 -22.86,5.08; B9 -25.4,5.08; B10 -27.94,5.08; B11 -30.48,5.08; B12 -33.02,5.08; B13 -35.56,5.08; B14 -38.1,5.08; B15 -40.64,5.08; B16 -43.18,5.08; B17 -45.72,5.08; B18 -48.26,5.08; B19 -50.8,5.08; B20 -53.34,5.08; B21 -55.88,5.08; B22 -58.42,5.08; B23 -60.96,5.08; B24 -63.5,5.08; B25 -66.04,5.08; B26 -68.58,5.08; B27 -71.12,5.08; B28 -73.66,5.08; B29 -76.2,5.08; B30 -78.74,5.08; B31 -81.28,5.08; B32 -83.82,5.08; B33 -86.36,5.08; B34 -88.9,5.08; B35 -91.44,5.08; B36 -93.98,5.08
HDF15H = drill 0.9 octagon: 1 4.329,2.54 | drill 0.9 round: 2 2.043,2.54; 3 -0.243,2.54; 4 -2.529,2.54; 5 -4.815,2.54; 6 5.472,0; 7 3.186,0; 8 0.9,0; 9 -1.386,0; 10 -3.672,0; 11 4.329,-2.54; 12 2.043,-2.54; 13 -0.243,-2.54; 14 -2.529,-2.54; 15 -4.815,-2.54 | hole 3: -12.5,0; 12.5,0

### Placement (x,y rotation side)
IC1  99.06,43.18 180 top
IC2  99.06,59.69 180 top
IC3  99.06,76.2 180 top
IC4  99.06,92.71 180 top
IC5  21.59,78.74 0 top
IC6  12.7,11.43 90 top
IC7  12.7,30.48 90 top
IC8  48.26,11.43 90 top
IC9  48.26,30.48 90 top
IC10  30.48,11.43 90 top
IC11  30.48,30.48 90 top
IC12  134.62,92.71 180 top
IC13  134.62,76.2 180 top
IC14  134.62,59.69 180 top
IC15  134.62,43.18 180 top
IC16  58.42,78.74 270 top
IC17  58.42,53.34 0 top
IC18  117.79,17.78 270 top
IC19  96.52,16.19 270 top
R1  129.54,26.67 0 top
R2  129.54,24.13 0 top
R3  129.54,21.59 0 top
R4  129.54,19.05 0 top
R5  129.54,16.51 0 top
R6  129.54,13.97 0 top
R7  129.54,11.43 0 top
R8  129.54,8.89 0 top
ST1  -8.89,0 270 top  (outside the outline)
X1  139.7,16.51 90 top

### Tracks (layer width: path | path; a pad name or v marks a point on that pad's centre or on a via)
/CHARMODE  (2 unrouted)
/CHARPIXEL  (1 unrouted)
/CPU_RAM  (6 unrouted)
/CS_R0  (1 unrouted)
/CS_R1  (1 unrouted)
/CS_R2  (1 unrouted)
/CS_R3  (1 unrouted)
/OC_L0  (1 unrouted)
/OC_L1  (1 unrouted)
/OC_L2  (1 unrouted)
/OC_L3  (1 unrouted)
/RD  (1 unrouted)
/VGA_IO  (1 unrouted)
/VGA_MEM  (1 unrouted)
/WE_R0  (1 unrouted)
/WE_R1  (1 unrouted)
/WE_R2  (1 unrouted)
/WE_R3  (1 unrouted)
/WR  (1 unrouted)
A0  (1 unrouted)
A1  (1 unrouted)
A2  (1 unrouted)
A3  (1 unrouted)
A4  (1 unrouted)
A5  (1 unrouted)
A6  (1 unrouted)
A7  (1 unrouted)
A8  (1 unrouted)
A9  (1 unrouted)
A10  (1 unrouted)
A11  (1 unrouted)
A12  (1 unrouted)
A13  (1 unrouted)
A14  (1 unrouted)
A15  (1 unrouted)
A16  (1 unrouted)
CHROW0  (1 unrouted)
CHROW1  (1 unrouted)
CHROW2  (1 unrouted)
CHROW3  (1 unrouted)
CPU_RAM_DIR  (4 unrouted)
D0  (3 unrouted)
D1  (3 unrouted)
D2  (3 unrouted)
D3  (3 unrouted)
D4  (3 unrouted)
D5  (3 unrouted)
D6  (3 unrouted)
D7  (3 unrouted)
D8  (2 unrouted)
D9  (2 unrouted)
D10  (2 unrouted)
D11  (2 unrouted)
D12  (2 unrouted)
D13  (2 unrouted)
D14  (2 unrouted)
D15  (2 unrouted)
DCHR0  (3 unrouted)
DCHR1  (3 unrouted)
DCHR2  (3 unrouted)
DCHR3  (3 unrouted)
DCHR4  (3 unrouted)
DCHR5  (3 unrouted)
DCHR6  (3 unrouted)
DCHR7  (3 unrouted)
DCOL0  (4 unrouted)
DCOL1  (4 unrouted)
DCOL2  (4 unrouted)
DCOL3  (4 unrouted)
DCOL4  (4 unrouted)
DCOL5  (4 unrouted)
DCOL6  (4 unrouted)
DCOL7  (4 unrouted)
GND  (47 unrouted)
  pour Top: 0,100.33 151.13,100.33 151.13,0 0,0
  pour Bottom: 0,100.33 151.13,100.33 151.13,0 0,0
LATCH  (4 unrouted)
M/IO  (1 unrouted)
N$3  (1 unrouted)
N$4  (1 unrouted)
N$5  (1 unrouted)
N$6  (1 unrouted)
N$7  (1 unrouted)
N$8  (1 unrouted)
N$9  (1 unrouted)
N$10  (1 unrouted)
R0D0  (2 unrouted)
R0D1  (2 unrouted)
R0D2  (2 unrouted)
R0D3  (2 unrouted)
R0D4  (2 unrouted)
R0D5  (2 unrouted)
R0D6  (2 unrouted)
R0D7  (2 unrouted)
R1D0  (2 unrouted)
R1D1  (2 unrouted)
R1D2  (2 unrouted)
R1D3  (2 unrouted)
R1D4  (2 unrouted)
R1D5  (2 unrouted)
R1D6  (2 unrouted)
R1D7  (2 unrouted)
R2D0  (2 unrouted)
R2D1  (2 unrouted)
R2D2  (2 unrouted)
R2D3  (2 unrouted)
R2D4  (2 unrouted)
R2D5  (2 unrouted)
R2D6  (2 unrouted)
R2D7  (2 unrouted)
R3D0  (2 unrouted)
R3D1  (2 unrouted)
R3D2  (2 unrouted)
R3D3  (2 unrouted)
R3D4  (2 unrouted)
R3D5  (2 unrouted)
R3D6  (2 unrouted)
R3D7  (2 unrouted)
RA0  (5 unrouted)
RA1  (5 unrouted)
RA2  (5 unrouted)
RA3  (5 unrouted)
RA4  (5 unrouted)
RA5  (5 unrouted)
RA6  (5 unrouted)
RA7  (5 unrouted)
RA8  (5 unrouted)
RA9  (5 unrouted)
RA10  (5 unrouted)
RA11  (5 unrouted)
RA12  (5 unrouted)
RA13  (5 unrouted)
RA14  (5 unrouted)
RGB_B  (2 unrouted)
RGB_G  (3 unrouted)
RGB_R  (3 unrouted)
VCC  (32 unrouted)